# Altium schematic sheet 5V_Regulator.SchDoc
size A
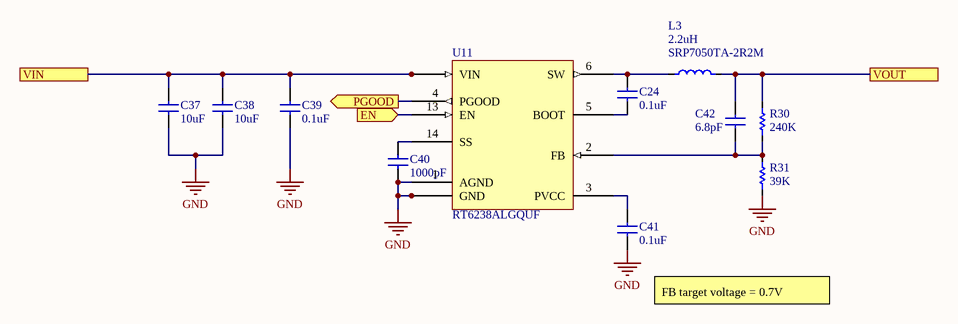
[diagram p0: 5V_Regulator.SchDoc]

## Parts
C24  value 0.1uF  [0603_CAPACITOR]  (hidden comment: CAP 0.1uF 50V X7R)
C37  value 10uF  [1206_CAPACITOR]  (hidden comment: CAP 10uF 50V X5R)
C38  value 10uF  [1206_CAPACITOR]  (hidden comment: CAP 10uF 50V X5R)
C39  value 0.1uF  [0603_CAPACITOR]  (hidden comment: CAP 0.1uF 50V X7R)
C40  value 1000pF  [0603_CAPACITOR]  (hidden comment: CAP 1000pF 50V X7R)
C41  value 0.1uF  [0603_CAPACITOR]  (hidden comment: CAP 0.1uF 50V X7R)
C42  value 6.8pF  [0603_CAPACITOR]  (hidden comment: CAP 6.8pF 50V NP0)
L3  SRP7050TA-2R2M  value 2.2uH  [L_SRP7050TA]
R30  value 240K  [0603_Resistor]  (hidden comment: R_0603_240K_1%)
R31  value 39K  [0603_Resistor]  (hidden comment: R_0603_39K_1%)
U11  RT6238ALGQUF  [UFQFN-14]

## Ports
EN (in), PGOOD (out), VIN, VOUT

## Nets
GND: C37.2 C38.2 C39.2 C40.2 C41.2 R31.1 U11.1(AGND) U11.9(GND) U11.10(GND) U11.11(GND) U11.12(GND)
EN: U11.13(EN) ; port EN
PGOOD: U11.4(PGOOD) ; port PGOOD
VIN: C37.1 C38.1 C39.1 U11.7(VIN) U11.8(VIN) ; port VIN
VOUT: C42.1 L3.2 R30.2 ; port VOUT
NetC24_1: C24.1 L3.1 U11.6(SW)
NetC24_2: C24.2 U11.5(BOOT)
NetC40_1: C40.1 U11.14(SS)
NetC41_1: C41.1 U11.3(PVCC)
NetC42_2: C42.2 R30.1 R31.2 U11.2(FB)

## Notes on the sheet
- (near C41) FB target voltage = 0.7V

## Library data of the parts
C24 C39 C41 = C_0603_0.1uF_50V_10%: CAP CERM 0.1uF 10% 50V 0603; SVP Creator: Spencer Berglund; Package: =SelectedPackage; Voltage: 50V; Temperature Coefficient: X7R; Supplier 1: Digi-Key; Supplier Part Number 1: 1276-1000-1-ND
C37 C38 = C_1206_10uF_50V_20%: CAP CERM 10uF 20% 50V 1206; SVP Creator: Spencer Berglund; Package: =SelectedPackage; Voltage: 50V; Temperature Coefficient: X5R; Supplier 1: Digi-Key; Supplier Part Number 1: 1276-6736-6-ND
C40 = C_0603_1000pF_50V_10%: CAP CERM 1000pF 10% 50V 0603; SVP Creator: Spencer Berglund; Package: =SelectedPackage; Voltage: 50V; Temperature Coefficient: X7R; Supplier 1: Digi-Key; Supplier Part Number 1: 1276-1018-1-ND
C42 = C_0603_6.8pF_50V_10%: CAP CERM 6.8pF 10% 50V 0603; SVP Creator: Spencer Berglund; Package: =SelectedPackage; Voltage: 50V; Temperature Coefficient: NP0; Supplier 1: Digi-Key; Supplier Part Number 1: 1276-1793-1-ND
L3 = L_SRP7050TA-2R2M: 2.2µH Shielded Wirewound Inductor 10A 12 mOhm Max Nonstandard; Manufacturer: Bourns; Core Material: Carbonyl Powder; Test Frequency: 100kHz; DC Resistance (DCR): 12mR; Inductance Tolerance: 20%; Saturation Current: 14A; Self Resonant Frequency: 30MHz; Supplier 1: Digi-Key; Supplier Part Number 1: SRP7050TA-2R2MDKR-ND; Current Rating: 10A; Max Operating Temperature: 150°C; RMS Current (Irms): 10A; Manufacturer Part Number: SRP7050TA-2R2M; Shielding: Shielded; Inductance: 2.2uh; Min Operating Temperature: -40°C; Tolerance: 20%; Composition: Wirewound
R30 R31 = R_0603_generic_1%: Generic 0603 Resistor; Manufacturer: Yageo; Power Rating: 0.1W; Temperature Coefficient: ±100ppm/°C; Tolerance: ±1%; Operating Temperature: -55°C ~ 155°C; Manufacturer Part Number: ='RC0603FR-07'+ValueFormatted+'L'; HelpURL: https://www.digikey.com/products/en/resistors/chip-resistor-surface-mount/52?pv17=103&FV=fffc000d%2Cc0001%2C1c0002%2C1f140000%2Cffe00034&k=RC0603; ValueFormatted: =Copy(Copy(Value, 0, Pos('.', Value)-1)+Copy(Value, Length(Value), 1)+Copy(Value, Pos('.', Value)+1, Length(Value)-Pos('.', Value)-1),1,Pos('.',Value)*Length(Value))+Copy(Value,1,Length(Value)*(1-Pos('.',Value)))
U11 = U_RT6238A: Buck Switching Regulator IC Positive Adjustable 0.7V 1 Output 8A 14-UFQFN; Supplier 1: Digi-Key; Supplier Part Number 1: RT6238ALGQUFDKR-ND